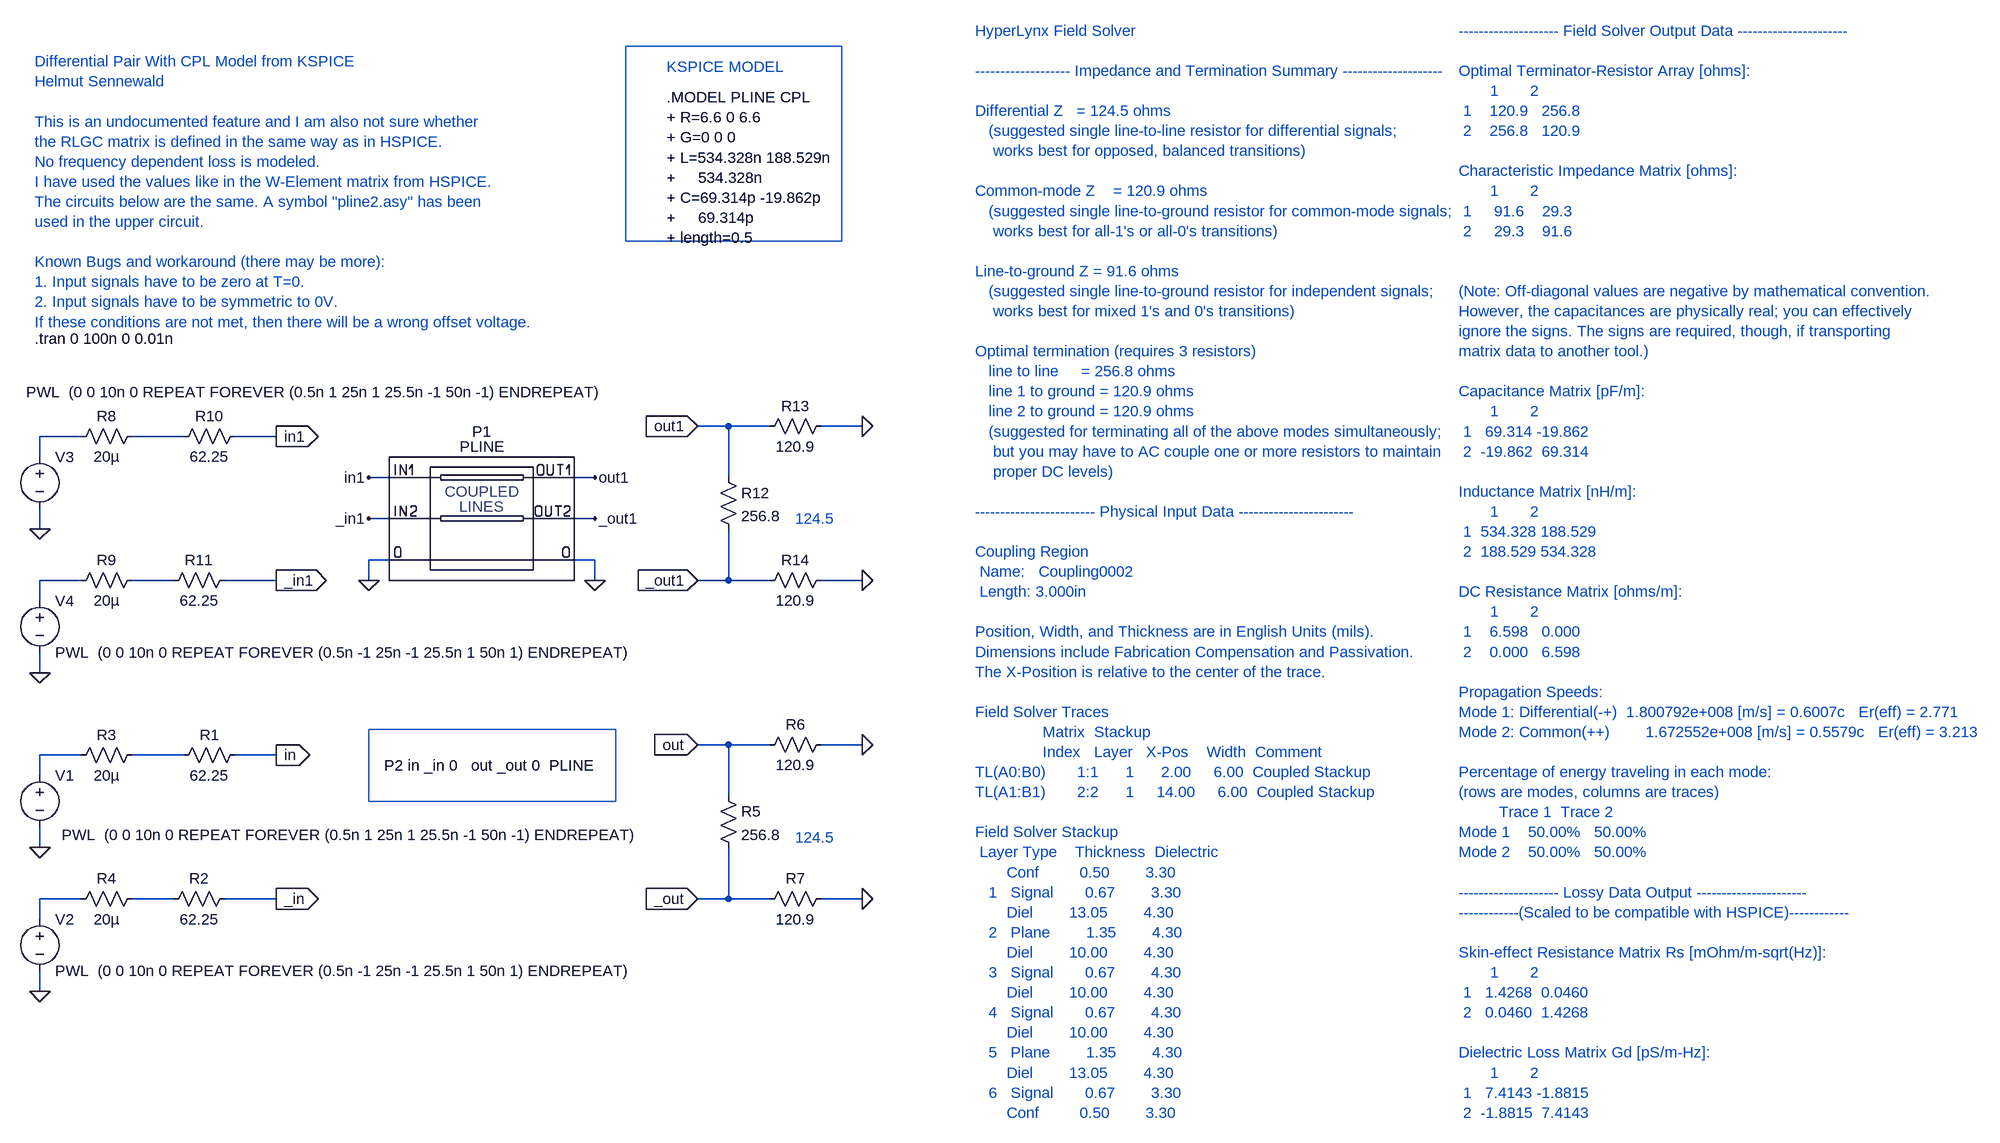
[diagram p0: schematic diff_pair_kspice.asc]
diff_pair_kspice.asc, the LTspice schematic file:
Version 4
SHEET 1 2716 2048
WIRE -608 -464 -608 -496
WIRE -608 -352 -608 -384
WIRE -608 -240 -608 -272
WIRE -608 -128 -608 -160
WIRE -608 32 -608 0
WIRE -608 144 -608 112
WIRE -608 256 -608 224
WIRE -608 368 -608 336
WIRE -544 -496 -608 -496
WIRE -544 -272 -608 -272
WIRE -544 0 -608 0
WIRE -544 224 -608 224
WIRE -400 -272 -464 -272
WIRE -400 224 -464 224
WIRE -384 -496 -464 -496
WIRE -384 0 -464 0
WIRE -240 -496 -304 -496
WIRE -240 -272 -320 -272
WIRE -240 0 -304 0
WIRE -240 224 -320 224
WIRE -96 -272 -96 -304
WIRE -64 -432 -96 -432
WIRE -64 -368 -96 -368
WIRE -64 -304 -96 -304
WIRE 256 -432 224 -432
WIRE 256 -368 224 -368
WIRE 256 -304 224 -304
WIRE 256 -272 256 -304
WIRE 464 -512 416 -512
WIRE 464 -432 464 -512
WIRE 464 -272 416 -272
WIRE 464 -272 464 -352
WIRE 464 -16 416 -16
WIRE 464 64 464 -16
WIRE 464 224 416 224
WIRE 464 224 464 144
WIRE 528 -512 464 -512
WIRE 528 -272 464 -272
WIRE 528 -16 464 -16
WIRE 528 224 464 224
WIRE 672 -512 608 -512
WIRE 672 -272 608 -272
WIRE 672 -16 608 -16
WIRE 672 224 608 224
FLAG -608 368 0
FLAG -608 144 0
FLAG 416 -16 out
IOPIN 416 -16 In
FLAG 416 224 _out
IOPIN 416 224 In
FLAG -240 0 in
IOPIN -240 0 Out
FLAG -240 224 _in
IOPIN -240 224 Out
FLAG 672 -16 0
FLAG 672 224 0
FLAG -96 -272 0
FLAG 256 -272 0
FLAG -608 -128 0
FLAG -608 -352 0
FLAG -240 -496 in1
IOPIN -240 -496 Out
FLAG -240 -272 _in1
IOPIN -240 -272 Out
FLAG 416 -512 out1
IOPIN 416 -512 In
FLAG 416 -272 _out1
IOPIN 416 -272 In
FLAG 672 -512 0
FLAG 672 -272 0
FLAG -96 -432 in1
FLAG 256 -432 out1
FLAG 256 -368 _out1
FLAG -96 -368 _in1
SYMBOL voltage -608 16 R0
WINDOW 123 0 0 Left 0
WINDOW 39 0 0 Left 0
WINDOW 3 34 108 Left 0
SYMATTR Value PWL  (0 0 10n 0 REPEAT FOREVER (0.5n 1 25n 1 25.5n -1 50n -1) ENDREPEAT)
SYMATTR InstName V1
SYMBOL voltage -608 240 R0
SYMATTR InstName V2
SYMATTR Value PWL  (0 0 10n 0 REPEAT FOREVER (0.5n -1 25n -1 25.5n 1 50n 1) ENDREPEAT)
SYMBOL res -560 16 R270
WINDOW 0 32 56 VTop 0
WINDOW 3 0 56 VBottom 0
SYMATTR InstName R3
SYMATTR Value 20µ
SYMBOL res -560 240 R270
WINDOW 0 32 56 VTop 0
WINDOW 3 0 56 VBottom 0
SYMATTR InstName R4
SYMATTR Value 20µ
SYMBOL res 448 48 R0
SYMATTR InstName R5
SYMATTR Value 256.8
SYMBOL res 512 0 R270
WINDOW 0 32 56 VTop 0
WINDOW 3 0 56 VBottom 0
SYMATTR InstName R6
SYMATTR Value 120.9
SYMBOL res 512 240 R270
WINDOW 0 32 56 VTop 0
WINDOW 3 0 56 VBottom 0
SYMATTR InstName R7
SYMATTR Value 120.9
SYMBOL res -400 16 R270
WINDOW 0 32 56 VTop 0
WINDOW 3 0 56 VBottom 0
SYMATTR InstName R1
SYMATTR Value 62.25
SYMBOL res -416 240 R270
WINDOW 0 32 56 VTop 0
WINDOW 3 0 56 VBottom 0
SYMATTR InstName R2
SYMATTR Value 62.25
SYMBOL voltage -608 -480 R0
WINDOW 123 0 0 Left 0
WINDOW 39 0 0 Left 0
WINDOW 3 -21 -85 Left 0
SYMATTR Value PWL  (0 0 10n 0 REPEAT FOREVER (0.5n 1 25n 1 25.5n -1 50n -1) ENDREPEAT)
SYMATTR InstName V3
SYMBOL voltage -608 -256 R0
SYMATTR InstName V4
SYMATTR Value PWL  (0 0 10n 0 REPEAT FOREVER (0.5n -1 25n -1 25.5n 1 50n 1) ENDREPEAT)
SYMBOL res -560 -480 R270
WINDOW 0 32 56 VTop 0
WINDOW 3 0 56 VBottom 0
SYMATTR InstName R8
SYMATTR Value 20µ
SYMBOL res -560 -256 R270
WINDOW 0 32 56 VTop 0
WINDOW 3 0 56 VBottom 0
SYMATTR InstName R9
SYMATTR Value 20µ
SYMBOL res -400 -480 R270
WINDOW 0 32 56 VTop 0
WINDOW 3 0 56 VBottom 0
SYMATTR InstName R10
SYMATTR Value 62.25
SYMBOL res -416 -256 R270
WINDOW 0 32 56 VTop 0
WINDOW 3 0 56 VBottom 0
SYMATTR InstName R11
SYMATTR Value 62.25
SYMBOL res 448 -448 R0
SYMATTR InstName R12
SYMATTR Value 256.8
SYMBOL res 512 -496 R270
WINDOW 0 32 56 VTop 0
WINDOW 3 0 56 VBottom 0
SYMATTR InstName R13
SYMATTR Value 120.9
SYMBOL res 512 -256 R270
WINDOW 0 32 56 VTop 0
WINDOW 3 0 56 VBottom 0
SYMATTR InstName R14
SYMATTR Value 120.9
SYMBOL CPL2 80 -400 R0
SYMATTR Value PLINE
SYMATTR InstName P1
TEXT -616 -648 Left 0 !.tran 0 100n 0 0.01n
TEXT -72 16 Left 0 !P2 in _in 0   out _out 0  PLINE
TEXT 368 -1024 Left 0 !.MODEL PLINE CPL\n+ R=6.6 0 6.6\n+ G=0 0 0\n+ L=534.328n 188.529n\n+     534.328n \n+ C=69.314p -19.862p\n+     69.314p\n+ length=0.5
TEXT 568 128 Left 0 ;124.5
TEXT 568 -368 Left 0 ;124.5
TEXT -616 -1080 Left 0 ;Differential Pair With CPL Model from KSPICE\nHelmut Sennewald\n \nThis is an undocumented feature and I am also not sure whether\nthe RLGC matrix is defined in the same way as in HSPICE.\nNo frequency dependent loss is modeled.\nI have used the values like in the W-Element matrix from HSPICE.\nThe circuits below are the same. A symbol "pline2.asy" has been \nused in the upper circuit.\n \nKnown Bugs and workaround (there may be more):\n1. Input signals have to be zero at T=0.\n2. Input signals have to be symmetric to 0V.\nIf these conditions are not met, then there will be a wrong offset voltage.
TEXT 848 -1128 Left 0 ;HyperLynx Field Solver\n \n------------------- Impedance and Termination Summary --------------------\n \nDifferential Z   = 124.5 ohms\n   (suggested single line-to-line resistor for differential signals;\n    works best for opposed, balanced transitions)\n \nCommon-mode Z    = 120.9 ohms\n   (suggested single line-to-ground resistor for common-mode signals;\n    works best for all-1's or all-0's transitions)\n \nLine-to-ground Z = 91.6 ohms\n   (suggested single line-to-ground resistor for independent signals;\n    works best for mixed 1's and 0's transitions)\n \nOptimal termination (requires 3 resistors)\n   line to line     = 256.8 ohms\n   line 1 to ground = 120.9 ohms\n   line 2 to ground = 120.9 ohms\n   (suggested for terminating all of the above modes simultaneously;\n    but you may have to AC couple one or more resistors to maintain\n    proper DC levels)\n \n------------------------ Physical Input Data -----------------------\n \nCoupling Region\n Name:   Coupling0002\n Length: 3.000in\n \nPosition, Width, and Thickness are in English Units (mils).\nDimensions include Fabrication Compensation and Passivation.\nThe X-Position is relative to the center of the trace.\n \nField Solver Traces\n               Matrix  Stackup\n               Index   Layer   X-Pos    Width  Comment\nTL(A0:B0)       1:1      1      2.00     6.00  Coupled Stackup\nTL(A1:B1)       2:2      1     14.00     6.00  Coupled Stackup\n \nField Solver Stackup \n Layer Type    Thickness  Dielectric\n       Conf         0.50        3.30\n   1   Signal       0.67        3.30\n       Diel        13.05        4.30\n   2   Plane        1.35        4.30\n       Diel        10.00        4.30\n   3   Signal       0.67        4.30\n       Diel        10.00        4.30\n   4   Signal       0.67        4.30\n       Diel        10.00        4.30\n   5   Plane        1.35        4.30\n       Diel        13.05        4.30\n   6   Signal       0.67        3.30\n       Conf         0.50        3.30
TEXT 1600 -1128 Left 0 ;-------------------- Field Solver Output Data ----------------------\n \nOptimal Terminator-Resistor Array [ohms]:\n       1       2\n 1    120.9   256.8\n 2    256.8   120.9\n \nCharacteristic Impedance Matrix [ohms]:\n       1       2\n 1     91.6    29.3\n 2     29.3    91.6\n \n \n(Note: Off-diagonal values are negative by mathematical convention.\nHowever, the capacitances are physically real; you can effectively\nignore the signs. The signs are required, though, if transporting\nmatrix data to another tool.)\n \nCapacitance Matrix [pF/m]:\n       1       2\n 1   69.314 -19.862\n 2  -19.862  69.314\n \nInductance Matrix [nH/m]:\n       1       2\n 1  534.328 188.529\n 2  188.529 534.328\n \nDC Resistance Matrix [ohms/m]:\n       1       2\n 1    6.598   0.000\n 2    0.000   6.598\n \nPropagation Speeds:\nMode 1: Differential(-+)  1.800792e+008 [m/s] = 0.6007c   Er(eff) = 2.771\nMode 2: Common(++)        1.672552e+008 [m/s] = 0.5579c   Er(eff) = 3.213\n \nPercentage of energy traveling in each mode:\n(rows are modes, columns are traces)\n         Trace 1  Trace 2 \nMode 1    50.00%   50.00% \nMode 2    50.00%   50.00% \n \n-------------------- Lossy Data Output ----------------------\n------------(Scaled to be compatible with HSPICE)------------\n \nSkin-effect Resistance Matrix Rs [mOhm/m-sqrt(Hz)]:\n       1       2\n 1   1.4268  0.0460\n 2   0.0460  1.4268\n \nDielectric Loss Matrix Gd [pS/m-Hz]:\n       1       2\n 1   7.4143 -1.8815\n 2  -1.8815  7.4143
TEXT 368 -1072 Left 0 ;KSPICE MODEL
RECTANGLE Normal 288 72 -96 -40
RECTANGLE Normal 640 -800 304 -1104

The netlist it stands for:
* diff_pair_kspice.asc
V1 N003 0 PWL  (0 0 10n 0 REPEAT FOREVER (0.5n 1 25n 1 25.5n -1 50n -1) ENDREPEAT)
V2 N004 0 PWL  (0 0 10n 0 REPEAT FOREVER (0.5n -1 25n -1 25.5n 1 50n 1) ENDREPEAT)
R3 N003 N008 20µ
R4 N004 N006 20µ
R5 out _out 256.8
R6 out 0 120.9
R7 _out 0 120.9
R1 N008 in 62.25
R2 N006 _in 62.25
V3 N001 0 PWL  (0 0 10n 0 REPEAT FOREVER (0.5n 1 25n 1 25.5n -1 50n -1) ENDREPEAT)
V4 N002 0 PWL  (0 0 10n 0 REPEAT FOREVER (0.5n -1 25n -1 25.5n 1 50n 1) ENDREPEAT)
R8 N001 N007 20µ
R9 N002 N005 20µ
R10 N007 in1 62.25
R11 N005 _in1 62.25
R12 out1 _out1 256.8
R13 out1 0 120.9
R14 _out1 0 120.9
P1 in1 _in1 0 out1 _out1 0 PLINE
.tran 0 100n 0 0.01n
P2 in _in 0   out _out 0  PLINE
.MODEL PLINE CPL
+ R=6.6 0 6.6
+ G=0 0 0
+ L=534.328n 188.529n
+     534.328n
+ C=69.314p -19.862p
+     69.314p
+ length=0.5
* 124.5
* 124.5
* Differential Pair With CPL Model from KSPICE
* Helmut Sennewald
* This is an undocumented feature and I am also not sure whether
* the RLGC matrix is defined in the same way as in HSPICE.
* No frequency dependent loss is modeled.
* I have used the values like in the W-Element matrix from HSPICE.
* The circuits below are the same. A symbol "pline2.asy" has been
* used in the upper circuit.
* Known Bugs and workaround (there may be more):
* 1. Input signals have to be zero at T=0.
* 2. Input signals have to be symmetric to 0V.
* If these conditions are not met, then there will be a wrong offset voltage.
* HyperLynx Field Solver
* ------------------- Impedance and Termination Summary --------------------
* Differential Z   = 124.5 ohms
*    (suggested single line-to-line resistor for differential signals;
*     works best for opposed, balanced transitions)
* Common-mode Z    = 120.9 ohms
*    (suggested single line-to-ground resistor for common-mode signals;
*     works best for all-1's or all-0's transitions)
* Line-to-ground Z = 91.6 ohms
*    (suggested single line-to-ground resistor for independent signals;
*     works best for mixed 1's and 0's transitions)
* Optimal termination (requires 3 resistors)
*    line to line     = 256.8 ohms
*    line 1 to ground = 120.9 ohms
*    line 2 to ground = 120.9 ohms
*    (suggested for terminating all of the above modes simultaneously;
*     but you may have to AC couple one or more resistors to maintain
*     proper DC levels)
* ------------------------ Physical Input Data -----------------------
* Coupling Region
*  Name:   Coupling0002
*  Length: 3.000in
* Position, Width, and Thickness are in English Units (mils).
* Dimensions include Fabrication Compensation and Passivation.
* The X-Position is relative to the center of the trace.
* Field Solver Traces
*                Matrix  Stackup
*                Index   Layer   X-Pos    Width  Comment
* TL(A0:B0)       1:1      1      2.00     6.00  Coupled Stackup
* TL(A1:B1)       2:2      1     14.00     6.00  Coupled Stackup
* Field Solver Stackup
*  Layer Type    Thickness  Dielectric
*        Conf         0.50        3.30
*    1   Signal       0.67        3.30
*        Diel        13.05        4.30
*    2   Plane        1.35        4.30
*        Diel        10.00        4.30
*    3   Signal       0.67        4.30
*        Diel        10.00        4.30
*    4   Signal       0.67        4.30
*        Diel        10.00        4.30
*    5   Plane        1.35        4.30
*        Diel        13.05        4.30
*    6   Signal       0.67        3.30
*        Conf         0.50        3.30
* -------------------- Field Solver Output Data ----------------------
* Optimal Terminator-Resistor Array [ohms]:
*        1       2
*  1    120.9   256.8
*  2    256.8   120.9
* Characteristic Impedance Matrix [ohms]:
*        1       2
*  1     91.6    29.3
*  2     29.3    91.6
* (Note: Off-diagonal values are negative by mathematical convention.
* However, the capacitances are physically real; you can effectively
* ignore the signs. The signs are required, though, if transporting
* matrix data to another tool.)
* Capacitance Matrix [pF/m]:
*        1       2
*  1   69.314 -19.862
*  2  -19.862  69.314
* Inductance Matrix [nH/m]:
*        1       2
*  1  534.328 188.529
*  2  188.529 534.328
* DC Resistance Matrix [ohms/m]:
*        1       2
*  1    6.598   0.000
*  2    0.000   6.598
* Propagation Speeds:
* Mode 1: Differential(-+)  1.800792e+008 [m/s] = 0.6007c   Er(eff) = 2.771
* Mode 2: Common(++)        1.672552e+008 [m/s] = 0.5579c   Er(eff) = 3.213
* Percentage of energy traveling in each mode:
* (rows are modes, columns are traces)
*          Trace 1  Trace 2
* Mode 1    50.00%   50.00%
* Mode 2    50.00%   50.00%
* -------------------- Lossy Data Output ----------------------
* ------------(Scaled to be compatible with HSPICE)------------
* Skin-effect Resistance Matrix Rs [mOhm/m-sqrt(Hz)]:
*        1       2
*  1   1.4268  0.0460
*  2   0.0460  1.4268
* Dielectric Loss Matrix Gd [pS/m-Hz]:
*        1       2
*  1   7.4143 -1.8815
*  2  -1.8815  7.4143
* KSPICE MODEL
.backanno
.end